# EAGLE design mysdramps (EAGLE 6.5.0)
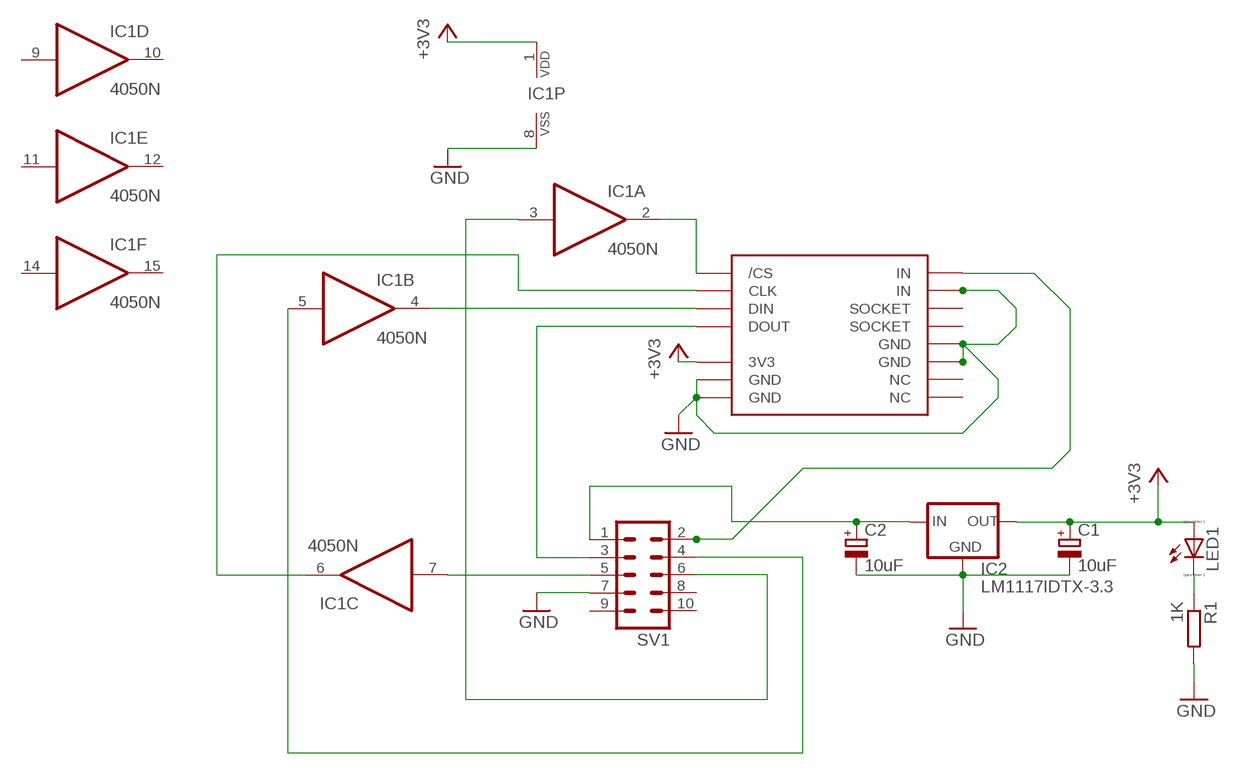
[diagram p0: schematic, sheet 1]

## Parts
C1  10uF  CPOL-EUE5-5  [E5-5]
C2  10uF  CPOL-EUE5-5  [E5-5]
IC1  4050N  [DIL16]
IC2  LM1117IDTX-3.3  [TO252]
LED1  LED_ELD260  [LED_LD260]
R1  1K  R-EU_0207/7  [0207/7]
SV1  MA05-2  [MA05-2]
U$1  MMC  [MMC_SOCKET]

## Nets
+3V3 [grubszy]: C1.+ IC1.1(P:VDD) IC2.TAB(OUT) LED1.A U$1.3V3
GND [grubszy]: C1.- C2.- IC1.8(P:VSS) IC2.1(GND) R1.2 SV1.7 U$1.GND@1(GND) U$1.GND@2(GND) U$1.GND@3(GND) U$1.GND@4(GND) U$1.IN@2(IN)
N$1 [grubszy]: SV1.3 U$1.DOUT
N$2 [grubszy]: LED1.K(C) R1.1
N$3 [grubszy]: C2.+ IC2.2(IN) SV1.1
N$4 [grubszy]: IC1.2(A:O) U$1./CS
N$5 [grubszy]: IC1.3(A:I) SV1.6
N$6 [grubszy]: IC1.4(B:O) U$1.DIN
N$7 [grubszy]: IC1.5(B:I) SV1.4
N$8 [grubszy]: IC1.6(C:O) U$1.CLK
N$9 [grubszy]: IC1.7(C:I) SV1.5
N$10: SV1.2 U$1.IN@1(IN)
Unconnected: IC1.9(D:I) IC1.10(D:O) IC1.11(E:I) IC1.12(E:O) IC1.14(F:I) IC1.15(F:O) SV1.8 SV1.9 SV1.10 U$1.NC@1(NC) U$1.NC@2(NC) U$1.P$1(SOCKET) U$1.P$2(SOCKET)

## Library data of the parts
C1 C2 = rcl:CPOL-EU: POLARIZED CAPACITOR, European symbol
IC1 = 40xx:4050: Hex non-inverting BUFFER
IC2 = lm1117:LM1117IDTX-*
LED1 = eagle-ltspice:LED_E: LED Source: http://www.osram.convergy.de Source: www.luxeon.com Source: www.kingbright.com; SPICEMODEL: NONE; SPICEPREFIX: D; SPICETYPE: diode
R1 = rcl:R-EU_: RESISTOR, European symbol
SV1 = con-lstb:MA05-2: PIN HEADER; OC_FARNELL: unknown; OC_NEWARK: unknown
U$1 = SD:MMC

## Net classes
1 grubszy: width 0.127 mm

## Board
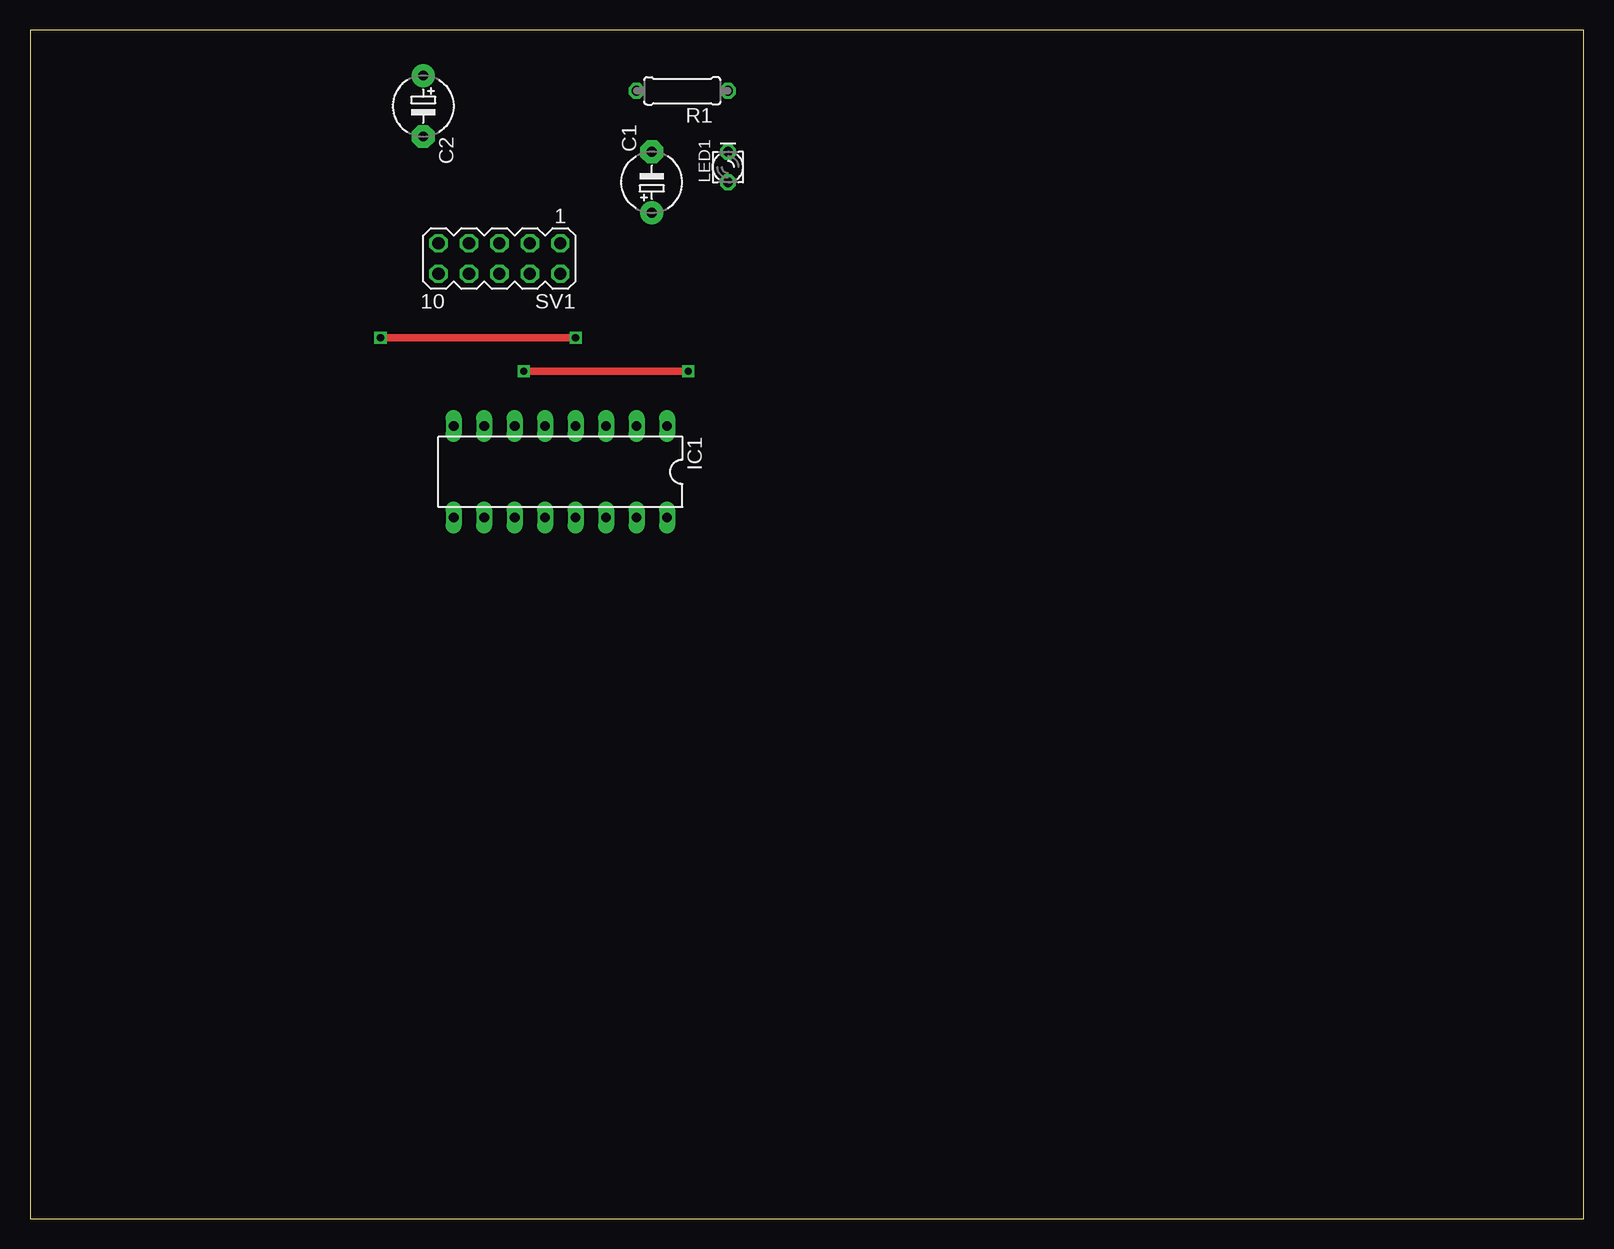
[diagram p1: board, top side]
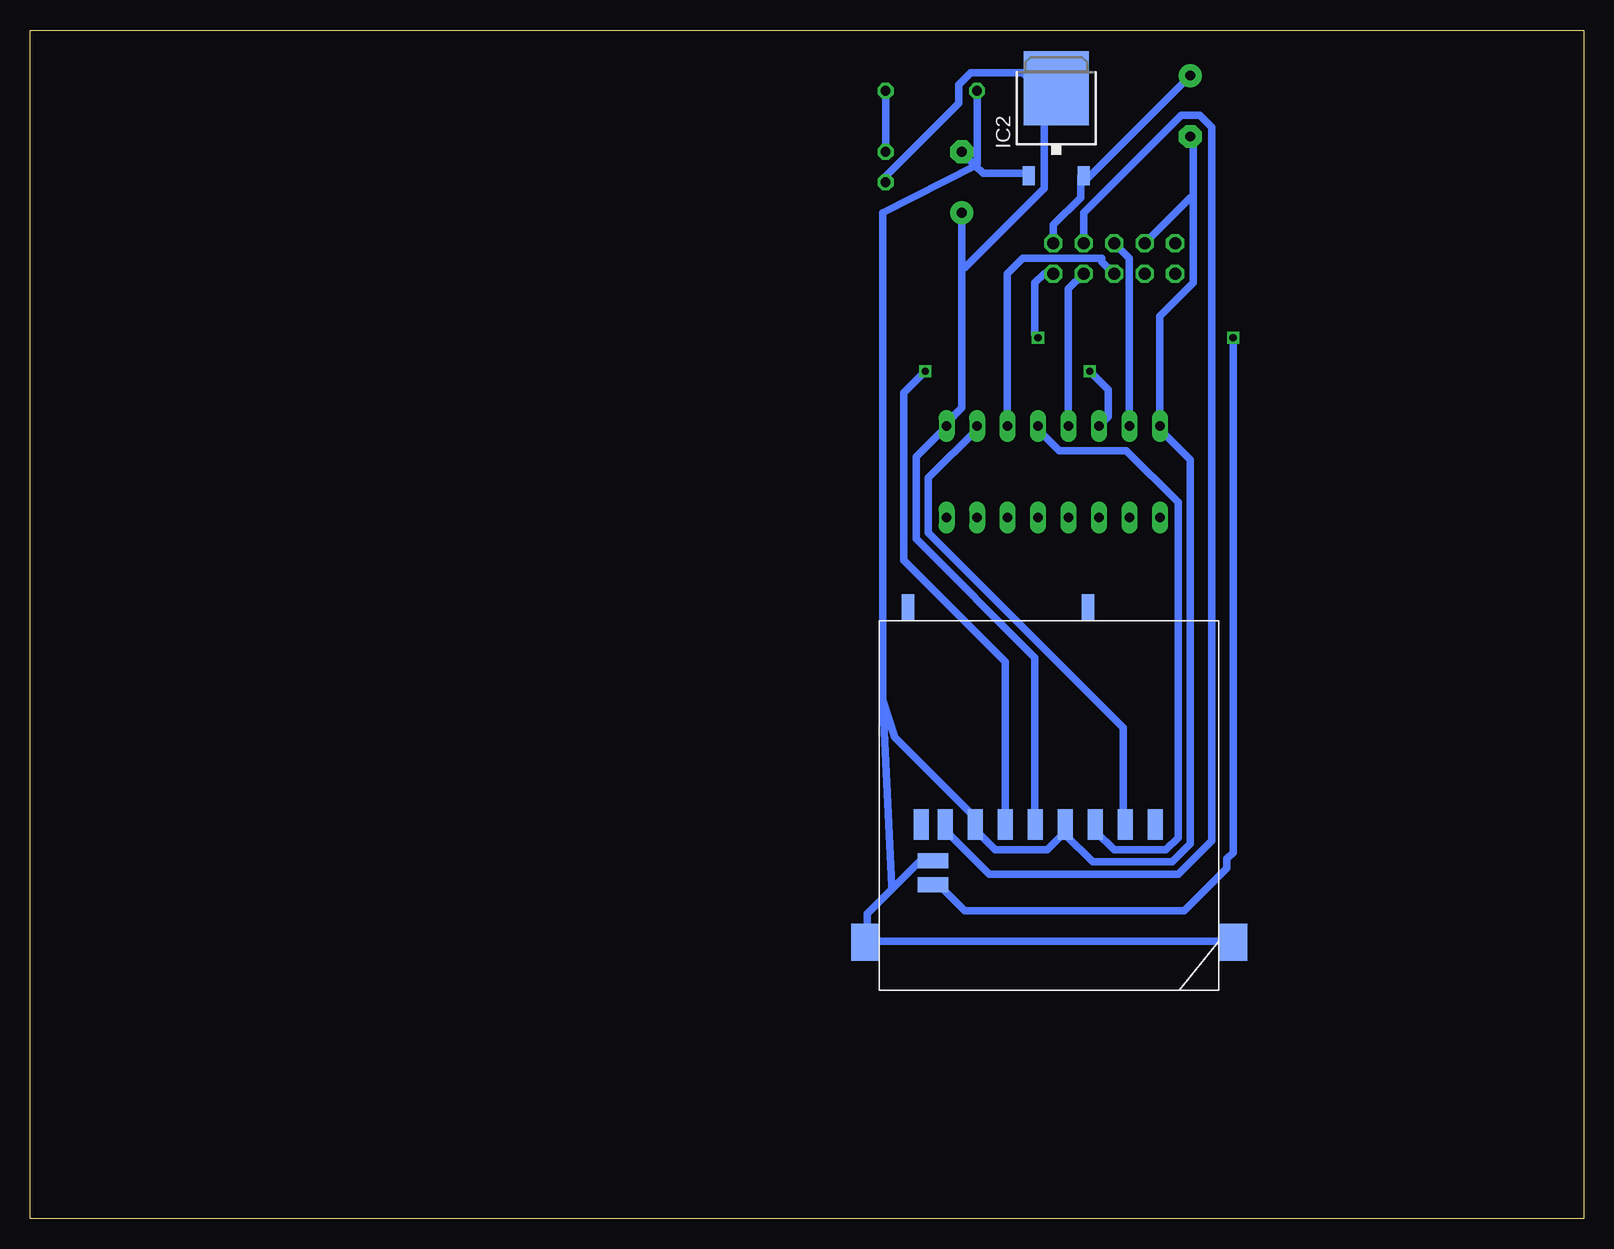
[diagram p2: board, bottom side, seen from below]

Size 129.46 x 99.05 mm. Coordinates in mm from the lower left corner, seen from the top.
Outline: 0,0 129.46,0 129.46,99.05 0,99.05 0,0
Copper layers (1*16): Top 0.035mm / dielectric 1.5mm / Bottom 0.035mm
Design rules "default *": minimum track width 24mil, minimum drill 24mil, track to track 15mil, track to pad 15mil, pad to pad 15mil, via to via 8mil, smd to smd 8mil, copper to edge 40mil, drill to drill 8mil, minimum pad ring 10mil, minimum via ring 8mil, stop-mask expansion 4mil, vias tented up to drill 0mil, thermal gap 10mil

### Footprints (pad centres in the part's own frame; a part is rotated, then mirrored left to right if it is on the bottom)
E5-5 = drill 0.813 pad 1.905: + -2.54,0 | drill 0.813 pad 1.905 octagon: - 2.54,0
DIL16 = drill 0.813 long: 1 -8.89,-3.81; 2 -6.35,-3.81; 3 -3.81,-3.81; 4 -1.27,-3.81; 5 1.27,-3.81; 6 3.81,-3.81; 7 6.35,-3.81; 8 8.89,-3.81; 9 8.89,3.81; 10 6.35,3.81; 11 3.81,3.81; 12 1.27,3.81; 13 -1.27,3.81; 14 -3.81,3.81; 15 -6.35,3.81; 16 -8.89,3.81
TO252 = smd 1 x 1.6: 1 -2.28,-4.8; 2 2.28,-4.8 | smd 5.4 x 6.2: TAB 0,2.5
LED_LD260 = drill 0.813 octagon: A -1.27,0; K 1.27,0
0207/7 = drill 0.813 octagon: 1 -3.81,0; 2 3.81,0
MA05-2 = drill 1.016 octagon: 1 -5.08,-1.27; 2 -5.08,1.27; 3 -2.54,-1.27; 4 -2.54,1.27; 5 0,-1.27; 6 0,1.27; 7 2.54,-1.27; 8 2.54,1.27; 9 5.08,-1.27; 10 5.08,1.27
MMC_SOCKET = smd 1.27 x 2.54: 3V3 1.5,4; /CS -6,4; CLK 4,4; DIN -3.5,4; DOUT 9,4; GND@1 -1,4; GND@2 6.5,4; NC@1 -8.5,4; NC@2 11,4 | smd 2.3 x 3.1: GND@3 15.7,13.8; GND@4 -15,13.8 | smd 2.54 x 1.27: IN@1 10,9; IN@2 10,7 | smd 1.067 x 2.184: P$1 -2.9,-14.1; P$2 12.1,-14.1

### Placement (x,y rotation side)
C1  51.82,86.36 90 top
C2  32.77,92.71 270 top
IC1  44.2,62.23 180 top
IC2  43.94,91.69 0 bottom
LED1  58.17,87.63 90 top
R1  54.36,93.98 180 top
SV1  39.12,80.01 180 top
U$1  44.2,36.83 180 bottom

### Tracks (layer width: path | path; a pad name or v marks a point on that pad's centre or on a via)
+3V3
  Bottom 0.61: U$1.3V3 45.72,33.02 45.72,46.74 55.63,56.64 55.63,63.5 IC1.1 53.09,66.29 51.82,67.56 51.82,79.25 | 51.82,79.25 C1.+ | 51.82,79.25 51.56,79.25 44.96,85.85 44.96,93.98 IC2.TAB 45.21,93.98 46.74,95.5 51.05,95.5 52.07,94.49 52.07,92.96 58.17,86.87 LED1.A
GND
  Bottom 0.406: 59.66,23.11 59.69,22.86 | 29.21,22.86 28.96,22.86
  Bottom 0.61: 32.51,85.09 32.51,89.92 C2.- | 32.51,85.09 32.51,77.98 35.31,75.18 IC1.8 35.31,65.79 32.77,63.25 32.77,31.24 34.29,29.72 40.89,29.72 43.18,32 U$1.GND@1 43.43,32.77 43.43,32 44.7,30.73 49.02,30.73 50.55,32.26 50.55,32.77 U$1.GND@2 50.8,33.02 50.8,33.53 57.4,40.13 58.42,43.18 | SV1.7 32.77,85.09 32.51,85.09 | 54.36,29.97 U$1.IN@2 54.61,29.97 55.12,29.97 57.53,27.56 | 29.21,22.86 U$1.GND@4 29.46,23.11 59.44,23.11 U$1.GND@3 | U$1.GND@3 59.69,23.11 59.66,23.11 | C1.- 50.67,87.76 | 50.67,87.76 50.04,87.12 46.23,87.12 IC2.1 | R1.2 50.55,87.88 50.67,87.76 | 57.53,27.56 59.69,25.4 59.69,23.37 U$1.GND@3 | 50.67,87.76 58.42,83.82 58.42,43.18 | 58.42,43.18 57.66,27.69 57.53,27.56
N$1
  Bottom 0.61: SV1.3 41.66,83.82 33.53,91.95 32,91.95 30.99,90.93 30.99,31.5 33.78,28.7 49.53,28.7 53.09,32.26 53.09,32.77 U$1.DOUT
N$2
  Bottom 0.61: R1.1 LED1.K
N$3
  Bottom 0.61: SV1.1 44.2,82.8 41.91,85.09 41.91,86.87 IC2.2 41.66,86.36 C2.+
N$4
  Bottom 0.61: IC1.2 50.55,65.79 54.61,61.72 54.61,57.15 38.35,40.89 38.35,33.02 U$1./CS
N$5
  Bottom 0.61: IC1.3 48.01,78.74 46.74,80.01 40.13,80.01 40.13,79.76 SV1.6
N$6
  Bottom 0.61: IC1.4 45.47,65.79 43.69,64.01 38.1,64.01 33.78,59.69 33.78,31.75 34.8,30.73 39.12,30.73 40.64,32.26 40.64,32.77 U$1.DIN
N$7
  Bottom 0.61: IC1.5 42.93,77.47 SV1.4
N$8  (via drill 0.6)
  Top 0.61: v54.86,70.61 v41.15,70.61
  Bottom 0.61: U$1.CLK 48.2,46.42 56.64,54.86 56.64,68.83 v54.86,70.61 | v41.15,70.61 39.62,69.09 39.62,66.8 IC1.6
N$9
  Bottom 0.61: IC1.7 37.85,80.01 SV1.5
N$10  (via drill 0.6)
  Top 0.61: v29.21,73.41 v45.47,73.41
  Bottom 0.61: U$1.IN@1 53.74,27.83 51.56,25.65 33.27,25.65 29.72,29.21 29.72,29.97 29.21,30.48 v29.21,73.41 | v45.47,73.41 45.72,73.66 45.72,77.98 44.96,78.74 SV1.2